# EAGLE design 50HzFNGen (EAGLE 6.5.0)
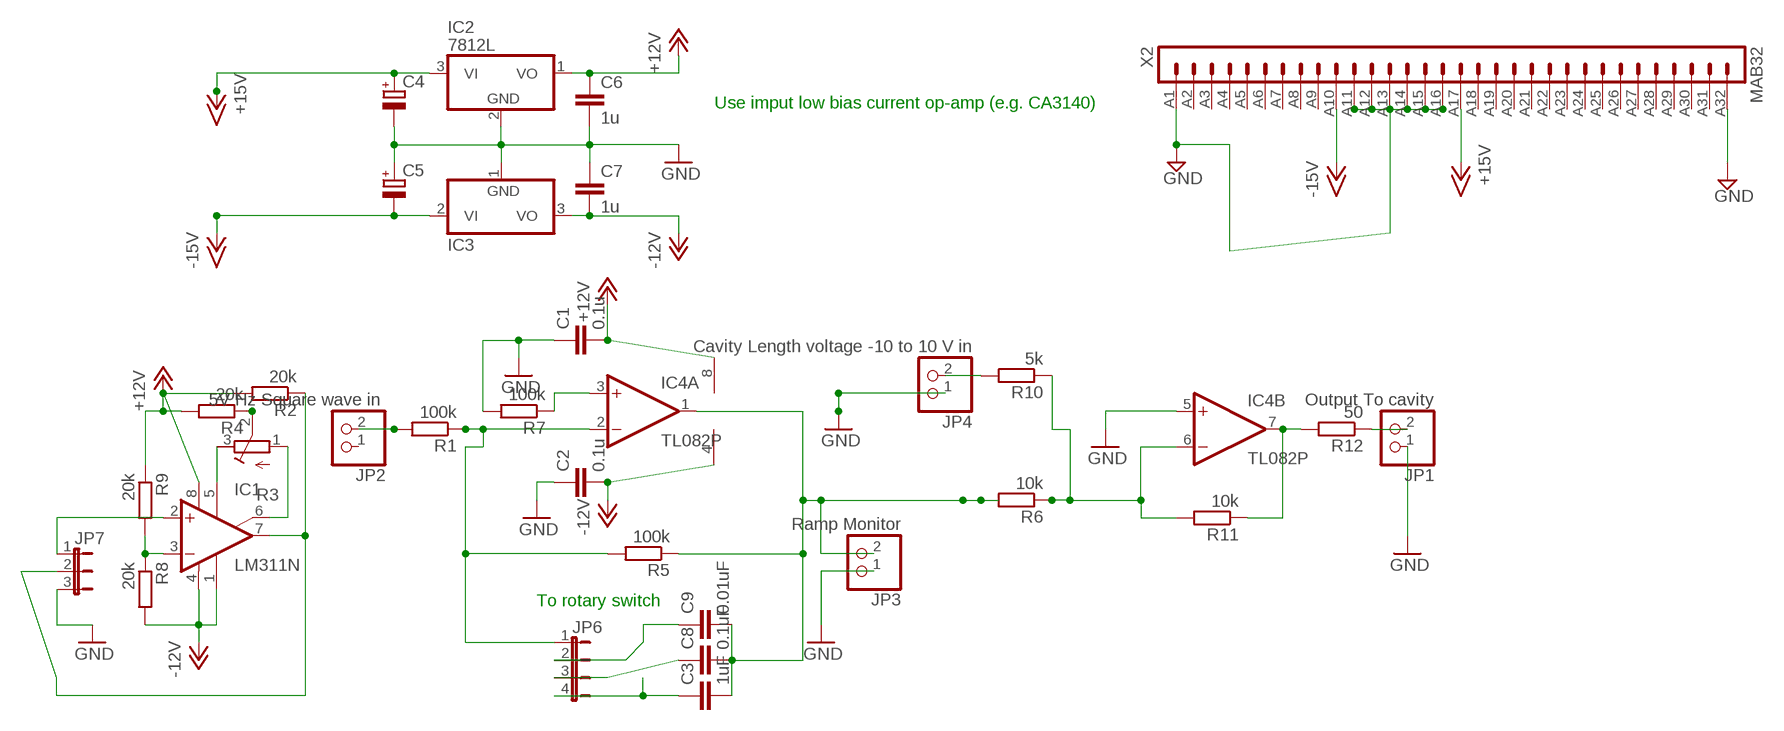
[diagram p0: schematic, sheet 1]

## Parts
C1  0.1u  C-EU025-025X050  [C025-025X050]
C2  0.1u  C-EU025-025X050  [C025-025X050]
C3  1uF  C-EU225-062X268  [C225-062X268]
C4  CPOL-EUE5-8.5  [E5-8,5]
C5  CPOL-EUE5-8.5  [E5-8,5]
C6  1u  C-EU050-030X075  [C050-030X075]
C7  1u  C-EU050-030X075  [C050-030X075]
C8  0.1uF  C-EU102-043X133  [C102-043X133]
C9  0.01uF  C-EU050-025X075  [C050-025X075]
IC1  LM311N  [DIL08]
IC2  7812L  [TO92]
IC3  7912L  [TO92]
IC4  TL082P  [DIL08]
JP1  Output To cavity  PINHD-1X2  [1X02]
JP2  5V Hz Square wave in  PINHD-1X2  [1X02]
JP3  Ramp Monitor  PINHD-1X2  [1X02]
JP4  Cavity Length voltage -10 to 10 V in  PINHD-1X2  [1X02]
JP6  JP4E  [JP4]
JP7  JP2E  [JP2]
R1  100k  R-EU_0207/10  [0207/10]
R2  20k  R-EU_0207/10  [0207/10]
R3  R-TRIMM64P  [RTRIM64P]
R4  20k  R-EU_0207/10  [0207/10]
R5  100k  R-EU_0207/10  [0207/10]
R6  10k  R-EU_0207/10  [0207/10]
R7  100k  R-EU_0207/10  [0207/10]
R8  20k  R-EU_0207/10  [0207/10]
R9  20k  R-EU_0207/10  [0207/10]
R10  5k  R-EU_0207/10  [0207/10]
R11  10k  R-EU_0207/10  [0207/10]
R12  50  R-EU_0207/10  [0207/10]
X2  MAB32  [MAB32]

## Nets
+12V: C1.2 C6.1 IC1.8(V+) IC2.1(VO) IC4.8(P:V+) R2.2 R4.2 R9.1
+15V: C4.+ IC2.3(VI) X2.A17
-12V: C2.2 C7.2 IC1.1(GND) IC1.4(V-) IC3.3(VO) IC4.4(P:V-) R8.2
-15V: C5.- IC3.2(VI) X2.A10
GND: C1.1 C2.1 C4.- C5.+ C6.2 C7.1 IC2.2(GND) IC3.1(GND) IC4.5(B:+IN) JP1.1 JP3.1 JP4.1 JP7.3 R7.2 X2.A1 X2.A11 X2.A12 X2.A14 X2.A15 X2.A16 X2.A32
N$4: C3.1 JP6.4
N$7: IC4.6(B:-IN) R6.1 R10.1 R11.2
N$9: IC4.7(B:OUT) R11.1 R12.2
N$10: JP1.2 R12.1
N$11: C8.1 JP6.3
N$12: IC1.7(OUT) JP7.2 R2.1
N$13: JP2.2 R1.2
N$14: C3.2 C8.2 C9.2 IC4.1(A:OUT) JP3.2 R5.1 R6.2
N$15: C9.1 JP6.2
N$16: IC1.5(ON) R3.3(A)
N$17: IC4.2(A:-IN) JP6.1 R1.1 R5.2
N$18: IC1.6(ON/STR) R3.1(E)
N$19: R3.2(S) R4.1
N$20: IC4.3(A:+IN) R7.1
N$21: JP4.2 R10.2
N$23: IC1.2(+IN) JP7.1
N$25: IC1.3(-IN) R8.1 R9.2
Unconnected: JP2.1 X2.A2 X2.A3 X2.A4 X2.A5 X2.A6 X2.A7 X2.A8 X2.A9 X2.A13 X2.A18 X2.A19 X2.A20 X2.A21 X2.A22 X2.A23 X2.A24 X2.A25 X2.A26 X2.A27 X2.A28 X2.A29 X2.A30 X2.A31

## Notes on the sheet
- Use imput low bias current op-amp (e.g. CA3140)
- To rotary switch

## Library data of the parts
C1-C3 C6-C9 = rcl:C-EU: CAPACITOR, European symbol
C4 C5 = rcl:CPOL-EU: POLARIZED CAPACITOR, European symbol
IC1 = linear:LM311: COMPARATOR
IC2 = linear:78*: Positive VOLTAGE REGULATOR Source: http://cache.national.com/ds/LM/LM78L05.pdf http://www.fairchildsemi.com/ds/LM/LM7805.pdf
IC3 = linear:79*: Negative VOLTAGE REGULATOR
IC4 = linear:TL082: OP AMP
JP1-JP4 = pinhead:PINHD-1X2: PIN HEADER
JP6 = jumper:JP4E: JUMPER
JP7 = jumper:JP2E: JUMPER
R1 R2 R4-R12 = resistor:R-EU_: RESISTOR, European symbol
R3 = resistor:R-TRIMM: Trimm resistor
X2 = con-vg:MAB32: CONNECTOR male, 32 pins, type B, row A, grid 2.54 mm

## Board
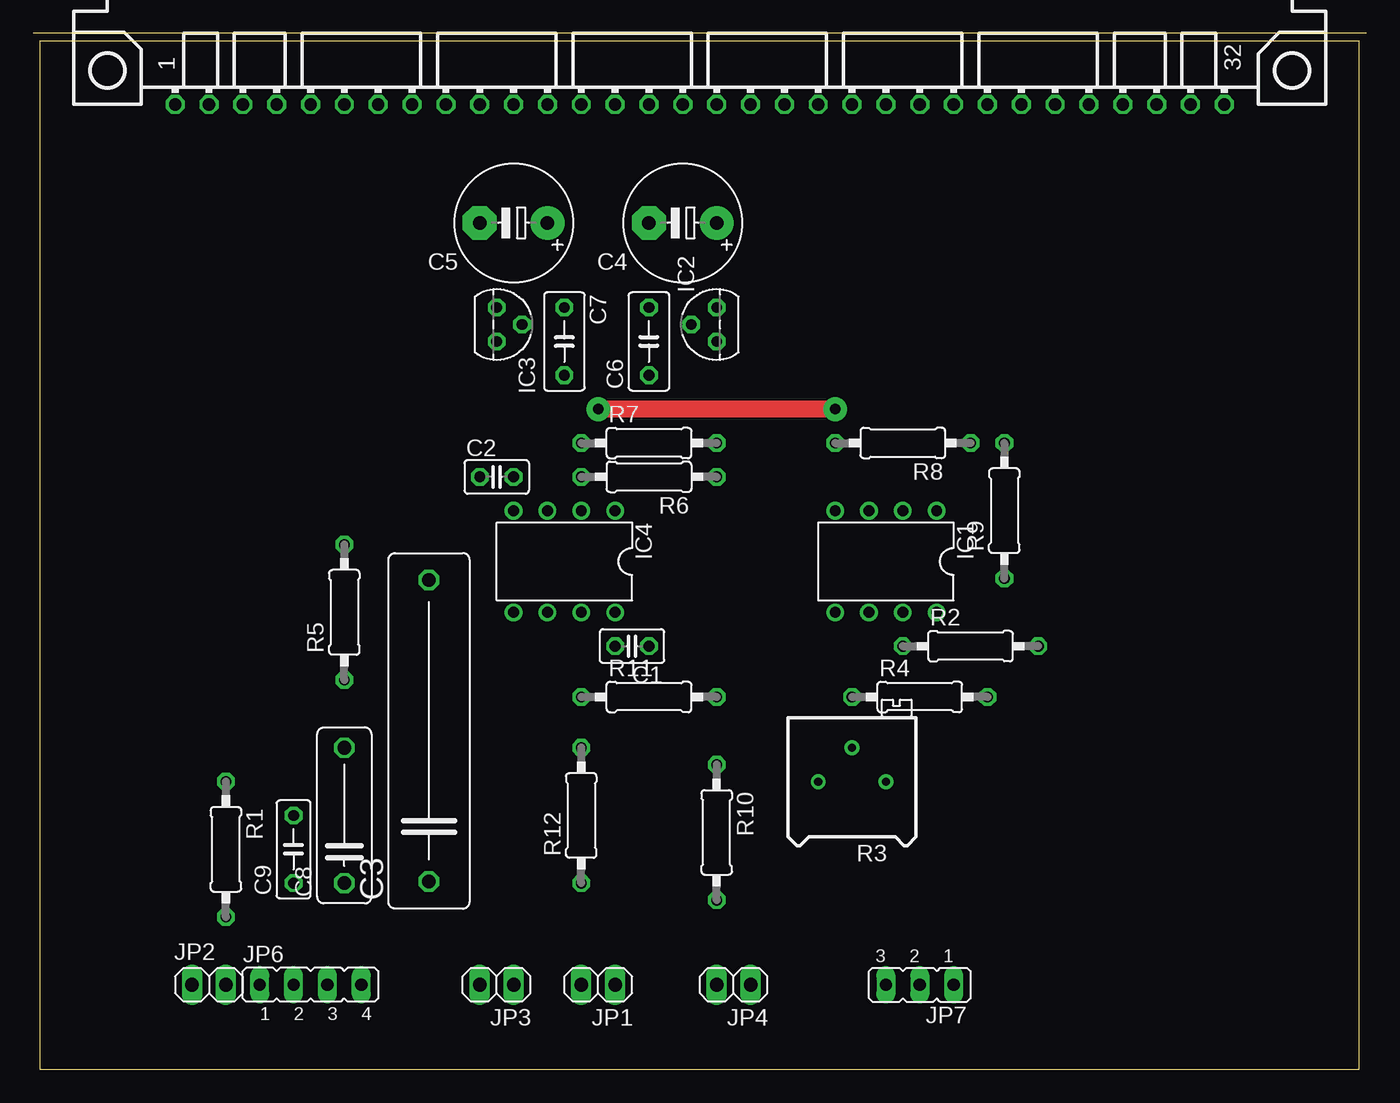
[diagram p1: board, top side]
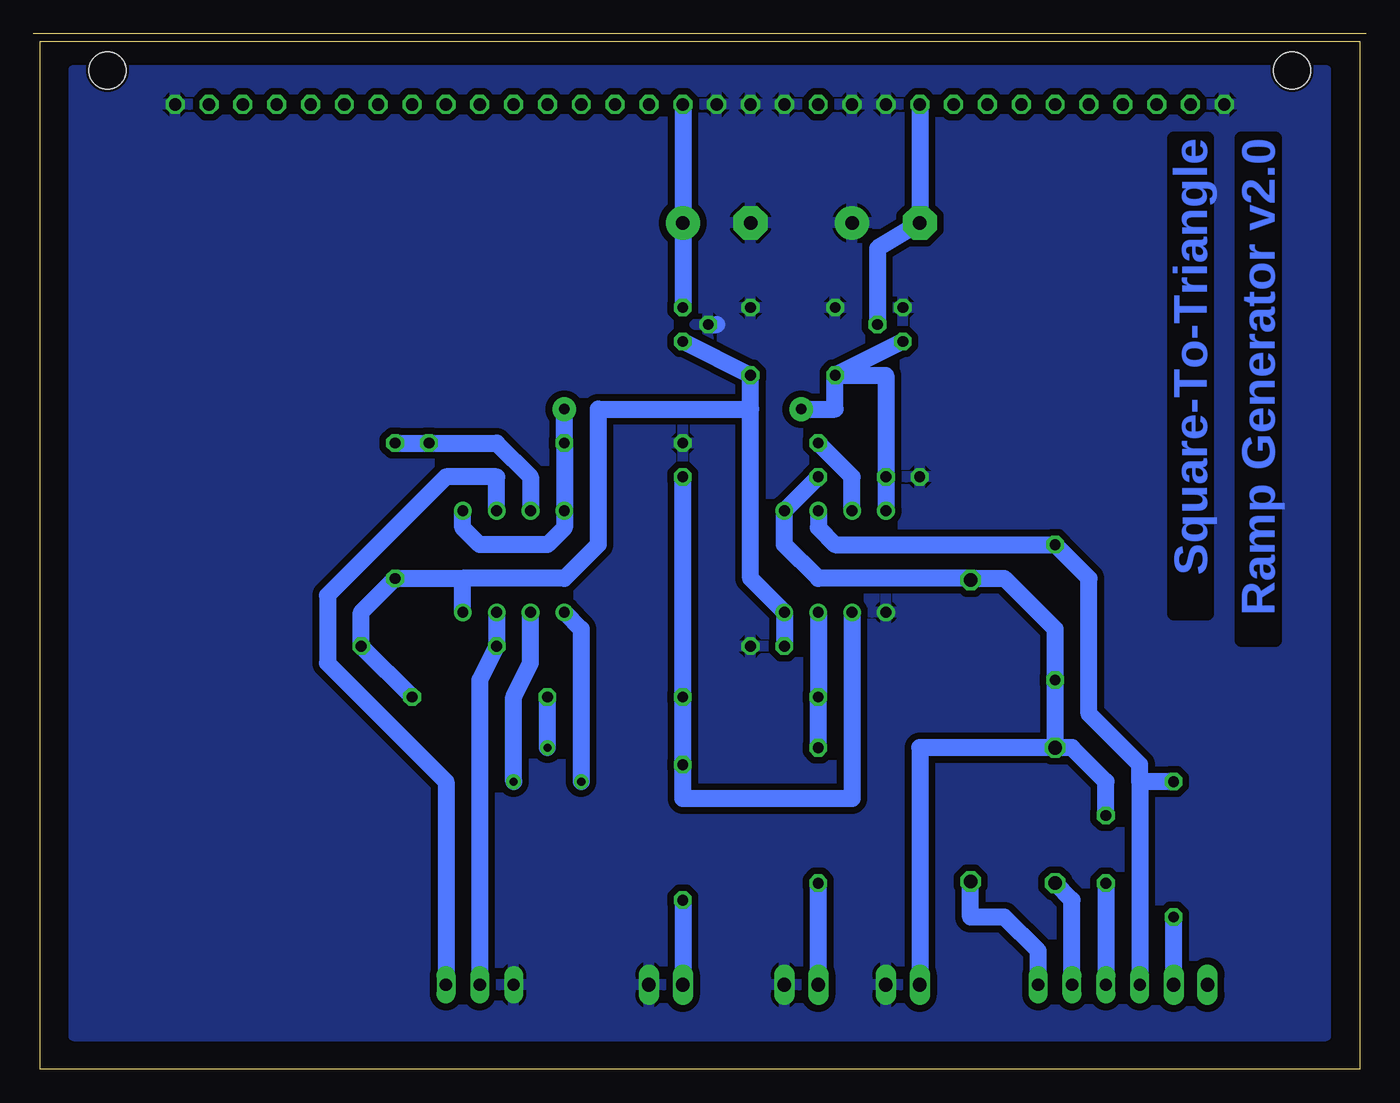
[diagram p2: board, bottom side, seen from below]

Size 99.04 x 77.14 mm. Coordinates in mm from the lower left corner, seen from the top.
Outline: 0,0 99.04,0 99.04,77.14 0,77.14 0,0
Copper layers (1*16): Top 0.035mm / dielectric 1.5mm / Bottom 0.035mm
Design rules "default *": minimum track width 10mil, minimum drill 24mil, track to track 20mil, track to pad 14mil, pad to pad 8mil, via to via 8mil, smd to smd 8mil, copper to edge 8mil, drill to drill 8mil, minimum pad ring 10mil, minimum via ring 8mil, stop-mask expansion 4mil, vias tented up to drill 0mil, thermal gap 10mil

### Footprints (pad centres in the part's own frame; a part is rotated, then mirrored left to right if it is on the bottom)
C025-025X050 = drill 0.813 octagon: 1 -1.27,0; 2 1.27,0
C225-062X268 = drill 1.016 octagon: 1 -11.303,0; 2 11.303,0
E5-8,5 = drill 1.016 pad 2.54: + -2.54,0 | drill 1.016 pad 2.54 octagon: - 2.54,0
C050-030X075 = drill 0.813 octagon: 1 -2.54,0; 2 2.54,0
C102-043X133 = drill 1.016 octagon: 1 -5.08,0; 2 5.08,0
C050-025X075 = drill 0.813 octagon: 1 -2.54,0; 2 2.54,0
DIL08 = drill 0.813 pad 1.27: 1 -3.81,-3.81; 2 -1.27,-3.81; 3 1.27,-3.81; 4 3.81,-3.81; 5 3.81,3.81; 6 1.27,3.81; 7 -1.27,3.81; 8 -3.81,3.81
TO92 = drill 0.813 octagon: 1 -1.27,0; 2 0,1.905; 3 1.27,0
1X02 = drill 1.016 long: 1 -1.27,0; 2 1.27,0
JP4 = drill 0.914 long: 1 -3.81,0; 2 -1.27,0; 3 1.27,0; 4 3.81,0
JP2 = drill 0.914 long: 1 -2.54,0; 2 0,0; 3 2.54,0
0207/10 = drill 0.813 octagon: 1 -5.08,0; 2 5.08,0
RTRIM64P = drill 0.61: 1 0,-2.54; 2 2.54,0; 3 0,2.54
MAB32 = drill 0.914 octagon: A1 -2.54,39.37; A2 -2.54,36.83; A3 -2.54,34.29; A4 -2.54,31.75; A5 -2.54,29.21; A6 -2.54,26.67; A7 -2.54,24.13; A8 -2.54,21.59; A9 -2.54,19.05; A10 -2.54,16.51; A11 -2.54,13.97; A12 -2.54,11.43; A13 -2.54,8.89; A14 -2.54,6.35; A15 -2.54,3.81; A16 -2.54,1.27; A17 -2.54,-1.27; A18 -2.54,-3.81; A19 -2.54,-6.35; A20 -2.54,-8.89; A21 -2.54,-11.43; A22 -2.54,-13.97; A23 -2.54,-16.51; A24 -2.54,-19.05; A25 -2.54,-21.59; A26 -2.54,-24.13; A27 -2.54,-26.67; A28 -2.54,-29.21; A29 -2.54,-31.75; A30 -2.54,-34.29; A31 -2.54,-36.83; A32 -2.54,-39.37 | hole 2.794: 0,44.45; 0,-44.45

### Placement (x,y rotation side)
C1  44.45,31.75 180 top
C2  34.29,44.45 0 top
C3  29.21,25.4 90 top
C4  48.26,63.5 180 top
C5  35.56,63.5 180 top
C6  45.72,54.61 90 top
C7  39.37,54.61 270 top
C8  22.86,19.05 90 top
C9  19.05,16.51 90 top
IC1  63.5,38.1 180 top
IC2  50.8,55.88 90 top
IC3  34.29,55.88 270 top
IC4  39.37,38.1 180 top
JP1  41.91,6.35 180 top
JP2  12.7,6.35 0 top
JP3  34.29,6.35 180 top
JP4  52.07,6.35 180 top
JP6  20.32,6.35 0 top
JP7  66.04,6.35 180 top
R1  13.97,16.51 270 top
R2  69.85,31.75 0 top
R3  60.96,21.59 90 top
R4  66.04,27.94 0 top
R5  22.86,34.29 90 top
R6  45.72,44.45 180 top
R7  45.72,46.99 0 top
R8  64.77,46.99 180 top
R9  72.39,41.91 90 top
R10  50.8,17.78 270 top
R11  45.72,27.94 0 top
R12  40.64,19.05 90 top
X2  49.53,74.93 90 top

### Tracks (layer width: path | path; a pad name or v marks a point on that pad's centre or on a via)
+12V
  Bottom 1.27: IC2.1 C6.1 45.72,49.53 | C1.2 IC4.8 45.72,36.83 45.72,49.53 | R4.2 R2.2 74.93,34.29 R9.1 67.31,36.83 | IC1.8 67.31,36.83 | 45.72,49.53 57.15,49.53 57.15,39.37 59.69,36.83 67.31,36.83
+15V
  Bottom 1.27: IC2.3 C4.+ X2.A17
-12V  (via drill 0.6, 0.8 pad 1.78)
  Top 1.27: v59.69,49.53 v41.91,49.53
  Bottom 1.27: IC3.3 C7.2 | C7.2 35.56,52.07 C2.2 IC4.4 | v59.69,49.53 R8.2 IC1.4 59.69,40.64 60.96,39.37 66.04,39.37 67.31,40.64 IC1.1 | v41.91,49.53 39.37,49.53 C7.2
-15V
  Bottom 1.27: X2.A10 C5.- 36.2,61.59 IC3.2
GND
  Bottom 1.27: IC2.2 48.26,55.88
  pour Bottom: 96.52,74.93 96.52,2.54 2.54,2.54 2.54,74.93
N$4
  Bottom 1.27: JP6.4 24.13,8.89 26.67,11.43 29.21,11.43 C3.1
N$7
  Bottom 1.27: R6.1 R11.2 R10.1 50.8,20.32 38.1,20.32 IC4.6
N$9
  Bottom 1.27: IC4.7 R11.1 R12.2
N$10
  Bottom 1.27: JP1.2 R12.1
N$11
  Bottom 1.27: JP6.3 21.59,12.7 C8.1
N$12
  Bottom 1.27: IC1.7 R2.1 66.04,29.21 JP7.2
N$13
  Bottom 1.27: JP2.2 R1.2
N$14
  Bottom 1.27: R6.2 IC4.1 43.18,39.37 40.64,36.83 29.34,36.83 C3.2 29.08,36.83 26.67,36.83 22.86,33.02 R5.1 C8.2 | C9.2 19.05,21.59 21.59,24.13 C8.2 | C8.2 33.02,24.13 JP3.2
N$15
  Bottom 1.27: C9.1 JP6.2
N$16
  Bottom 1.27: IC1.5 58.42,33.02 R3.3
N$17
  Bottom 1.27: 16.51,21.59 JP6.1 | R1.1 16.51,21.59 | 16.51,21.59 16.51,22.86 20.32,26.67 20.32,36.83 R5.2 39.37,39.37 40.64,40.64 IC4.2
N$18
  Bottom 1.27: R3.1 63.5,27.94 62.23,30.48 IC1.6
N$19
  Bottom 1.27: R3.2 R4.1
N$20
  Bottom 1.27: IC4.3 38.1,44.45 R7.1
N$21
  Bottom 1.27: R10.2 JP4.2
N$23
  Bottom 1.27: IC1.2 64.77,44.45 68.58,44.45 77.47,35.56 77.47,30.48 68.58,21.59 JP7.1
N$25
  Bottom 1.27: R9.2 R8.1 64.77,46.99 62.23,44.45 IC1.3

### Text on the board
Bottom: Ramp Generator v2.0 | Square-To-Triangle